# EAGLE design DRV8711 Breakout Minimal (EAGLE 7.5.0)
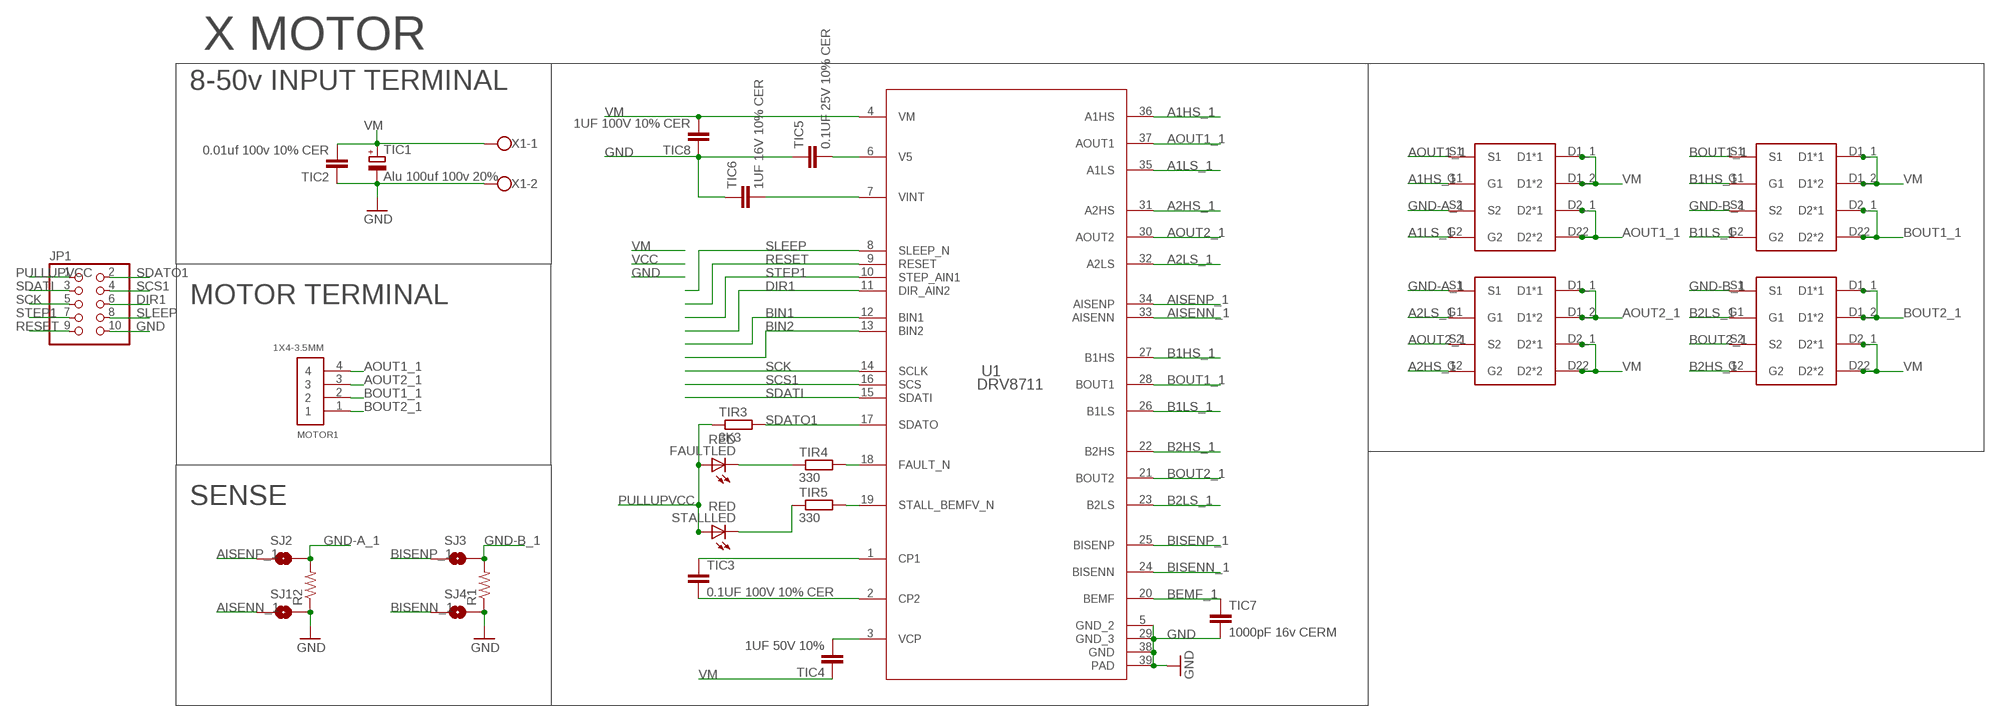
[diagram p0: schematic, sheet 1]

## Parts
FAULTLED  RED  LEDSMT1206  [1206]
JP1  PINHD-2X5  [2X05]
MOTOR1  1X4-3.5MM  [1X04-3.5MM]
R1  R-US_R2512  [R2512]
R2  R-US_R2512  [R2512]
SJ1  SOLDERJUMPERTRACE  [SJ_2S-TRACE]
SJ2  SOLDERJUMPERTRACE  [SJ_2S-TRACE]
SJ3  SOLDERJUMPERTRACE  [SJ_2S-TRACE]
SJ4  SOLDERJUMPERTRACE  [SJ_2S-TRACE]
STALLLED  RED  LEDSMT1206  [1206]
TIC1  Alu 100uf 100v 20%  CPOL-EUE  [PANASONIC_E]
TIC2  0.01uf 100v 10% CER  C-EUC1206K  [C1206K]
TIC3  0.1UF 100V 10% CER  C-EUC1206K  [C1206K]
TIC4  1UF 50V 10%  C-EUC1206K  [C1206K]
TIC5  0.1UF 25V 10% CER  C-EUC1206K  [C1206K]
TIC6  1UF 16V 10% CER  C-EUC1206K  [C1206K]
TIC7  1000pF 16v CERM  C-EUC1206K  [C1206K]
TIC8  1UF 100V 10% CER  C-EUC1206K  [C1206K]
TIR3  3K3  R-EU_R1206  [R1206]
TIR4  330  R-EU_R1206  [R1206]
TIR5  330  R-EU_R1206  [R1206]
U1  DRV8711  DRV8711DCPR  [DCP0038A_N]
U$1  CSD88537ND  [CSD88537ND]
U$2  CSD88537ND  [CSD88537ND]
U$3  CSD88537ND  [CSD88537ND]
U$4  CSD88537ND  [CSD88537ND]
X1  W237-102  [W237-102]

## Nets
A1HS_1: U1.36(A1HS) U$1.G1
A1LS_1: U1.35(A1LS) U$1.G2
A2HS_1: U1.31(A2HS) U$3.G2
A2LS_1: U1.32(A2LS) U$3.G1
AISENN_1: SJ1.1 U1.33(AISENN)
AISENP_1: SJ2.1 U1.34(AISENP)
AOUT1_1: MOTOR1.4 U1.37(AOUT1) U$1.D2_1(D2*1) U$1.D22(D2*2) U$1.S1
AOUT2_1: MOTOR1.3 U1.30(AOUT2) U$3.D1_1(D1*1) U$3.D1_2(D1*2) U$3.S2
B1HS_1: U1.27(B1HS) U$2.G1
B1LS_1: U1.26(B1LS) U$2.G2
B2HS_1: U1.22(B2HS) U$4.G2
B2LS_1: U1.23(B2LS) U$4.G1
BEMF_1: TIC7.1 U1.20(BEMF)
BIN1: U1.12(BIN1)
BIN2: U1.13(BIN2)
BISENN_1: SJ4.1 U1.24(BISENN)
BISENP_1: SJ3.1 U1.25(BISENP)
BOUT1_1: MOTOR1.2 U1.28(BOUT1) U$2.D2_1(D2*1) U$2.D22(D2*2) U$2.S1
BOUT2_1: MOTOR1.1 U1.21(BOUT2) U$4.D1_1(D1*1) U$4.D1_2(D1*2) U$4.S2
CP1_1: TIC3.1 U1.1(CP1)
CP2_1: TIC3.2 U1.2(CP2)
DIR1: JP1.6 U1.11(DIR_AIN2)
FAULT_N1: TIR4.2 U1.18(FAULT_N)
FAULTLED: FAULTLED.C TIR4.1
GND: JP1.10 R1.1 R2.1 SJ1.2 SJ4.2 TIC1.- TIC2.1 TIC5.1 TIC6.1 TIC7.2 TIC8.1 U1.5(GND_2) U1.29(GND_3) U1.38(GND) U1.39(PAD) X1.2
GND-A_1: R2.2 SJ2.2 U$1.S2 U$3.S1
GND-B_1: R1.2 SJ3.2 U$2.S2 U$4.S1
PULLUPVCC: FAULTLED.A JP1.1 STALLLED.A TIR3.1
RESET: JP1.9 U1.9(RESET)
SCK: JP1.5 U1.14(SCLK)
SCS1: JP1.4 U1.16(SCS)
SDATI: JP1.3 U1.15(SDATI)
SDATO1: JP1.2 TIR3.2 U1.17(SDATO)
SLEEP: JP1.8 U1.8(SLEEP_N)
STALL_N1: TIR5.2 U1.19(STALL_BEMFV_N)
STALLLED: STALLLED.C TIR5.1
STEP1: JP1.7 U1.10(STEP_AIN1)
V5_1: TIC5.2 U1.6(V5)
VCP1: TIC4.2 U1.3(VCP)
VINT1: TIC6.2 U1.7(VINT)
VM: TIC1.+ TIC2.2 TIC4.1 TIC8.2 U1.4(VM) U$1.D1_1(D1*1) U$1.D1_2(D1*2) U$2.D1_1(D1*1) U$2.D1_2(D1*2) U$3.D2_1(D2*1) U$3.D22(D2*2) U$4.D2_1(D2*1) U$4.D22(D2*2) X1.1

## Notes on the sheet
- X MOTOR
- 8-50v INPUT TERMINAL
- MOTOR TERMINAL
- SENSE

## Library data of the parts
FAULTLED STALLLED = led:LED: LED OSRAM: - CHIPLED LG R971, LG N971, LY N971, LG Q971, LY Q971, LO R971, LY R971 LH N974, LH R974 LS Q976, LO Q976, LY Q976 LO Q996 - Hyper CHIPLED LW Q18S LB Q993, LB Q99A, LB R99A - SideLED LS A670, LO A670, LY A670, LG A670, LP A670 LB A673, LV A673, LT A673, LW A673 LH A674 LY A675 LS A676, LA A676, LO A676, LY A676, LW A676 LS A679, LY A679, LG A679 - Hyper Micro SIDELED® LS Y876, LA Y876, LO Y876, LY Y876 LT Y87S - SmartLED LW L88C, LW L88S LB L89C, LB L89S, LG L890 LS L89K, LO L89K, LY L89K LS L896, LA L896, LO L896, LY L896 - TOPLED LS T670, LO T670, LY T670, LG T670, LP T670 LSG T670, LSP T670, LSY T670, LOP T670, LYG T670 LG T671, LOG T671, LSG T671 LB T673, LV T673, LT T673, LW T673 LH T674 LS T676, LA T676, LO T676, LY T676, LB T676, LH T676, LSB T676, LW T676 LB T67C, LV T67C, LT T67C, LS T67K, LO T67K, LY T67K, LW E67C LS E67B, LA E67B, LO E67B, LY E67B, LB E67C, LV E67C, LT E67C LW T67C LS T679, LY T679, LG T679 LS T770, LO T770, LY T770, LG T770, LP T770 LB T773, LV T773, LT T773, LW T773 LH T774 LS E675, LA E675, LY E675, LS T675 LS T776, LA T776, LO T776, LY T776, LB T776 LHGB T686 LT T68C, LB T68C - Hyper Mini TOPLED® LB M676 - Mini TOPLED Santana® LG M470 LS M47K, LO M47K, LY M47K Source: http://www.osram.convergy.de LUXEON: - LUMILED® LXK2-PW12-R00, LXK2-PW12-S00, LXK2-PW14-U00, LXK2-PW14-V00 LXK2-PM12-R00, LXK2-PM12-S00, LXK2-PM14-U00 LXK2-PE12-Q00, LXK2-PE12-R00, LXK2-PE12-S00, LXK2-PE14-T00, LXK2-PE14-U00 LXK2-PB12-K00, LXK2-PB12-L00, LXK2-PB12-M00, LXK2-PB14-N00, LXK2-PB14-P00, LXK2-PB14-Q00 LXK2-PR12-L00, LXK2-PR12-M00, LXK2-PR14-Q00, LXK2-PR14-R00 LXK2-PD12-Q00, LXK2-PD12-R00, LXK2-PD12-S00 LXK2-PH12-R00, LXK2-PH12-S00 LXK2-PL12-P00, LXK2-PL12-Q00, LXK2-PL12-R00 Source: www.luxeon.com KINGBRIGHT: KA-3528ASYC Source: www.kingbright.com
JP1 = pinhead:PINHD-2X5: PIN HEADER
MOTOR1 = adafruit:1X4: 4-pin connector
R1 R2 = adafruit:R-US_: RESISTOR, American symbol
SJ1-SJ4 = SparkFun:SOLDERJUMPER: Solder Jumper Standard SMD solder jumper. Used to automate production. Two varients : Normally Open and Normally Closed are the same, but have different paste layers. NC will have a large amount of paste and should jumper during reflow.
TIC1 = resistor:CPOL-EU: POLARIZED CAPACITOR, European symbol
TIC2-TIC8 = rcl:C-EU: CAPACITOR, European symbol
TIR3-TIR5 = rcl:R-EU_: RESISTOR, European symbol
U1 = tidrv8711:DRV8711DCPR; ALTERNATEPARTNUMBER: DRV8711DCP; COMPTYPE: IC; MANUFACTURER: Texas Instruments; MOUNTTYPE: SMT; PACKAGEREFERENCE: DCP0038A; PARTNUMBER: DRV8711DCPR; PIN_COUNT: 39; REFDES: RefDes; ROHS: Y; TYPE: TYPE; VALUE: Value
U$1-U$4 = tidrv8711:CSD88537ND
X1 = con-wago-500:W237-102: WAGO SCREW CLAMP; MPN: 237-102; OC_FARNELL: unknown; OC_NEWARK: 70K9898

## Board
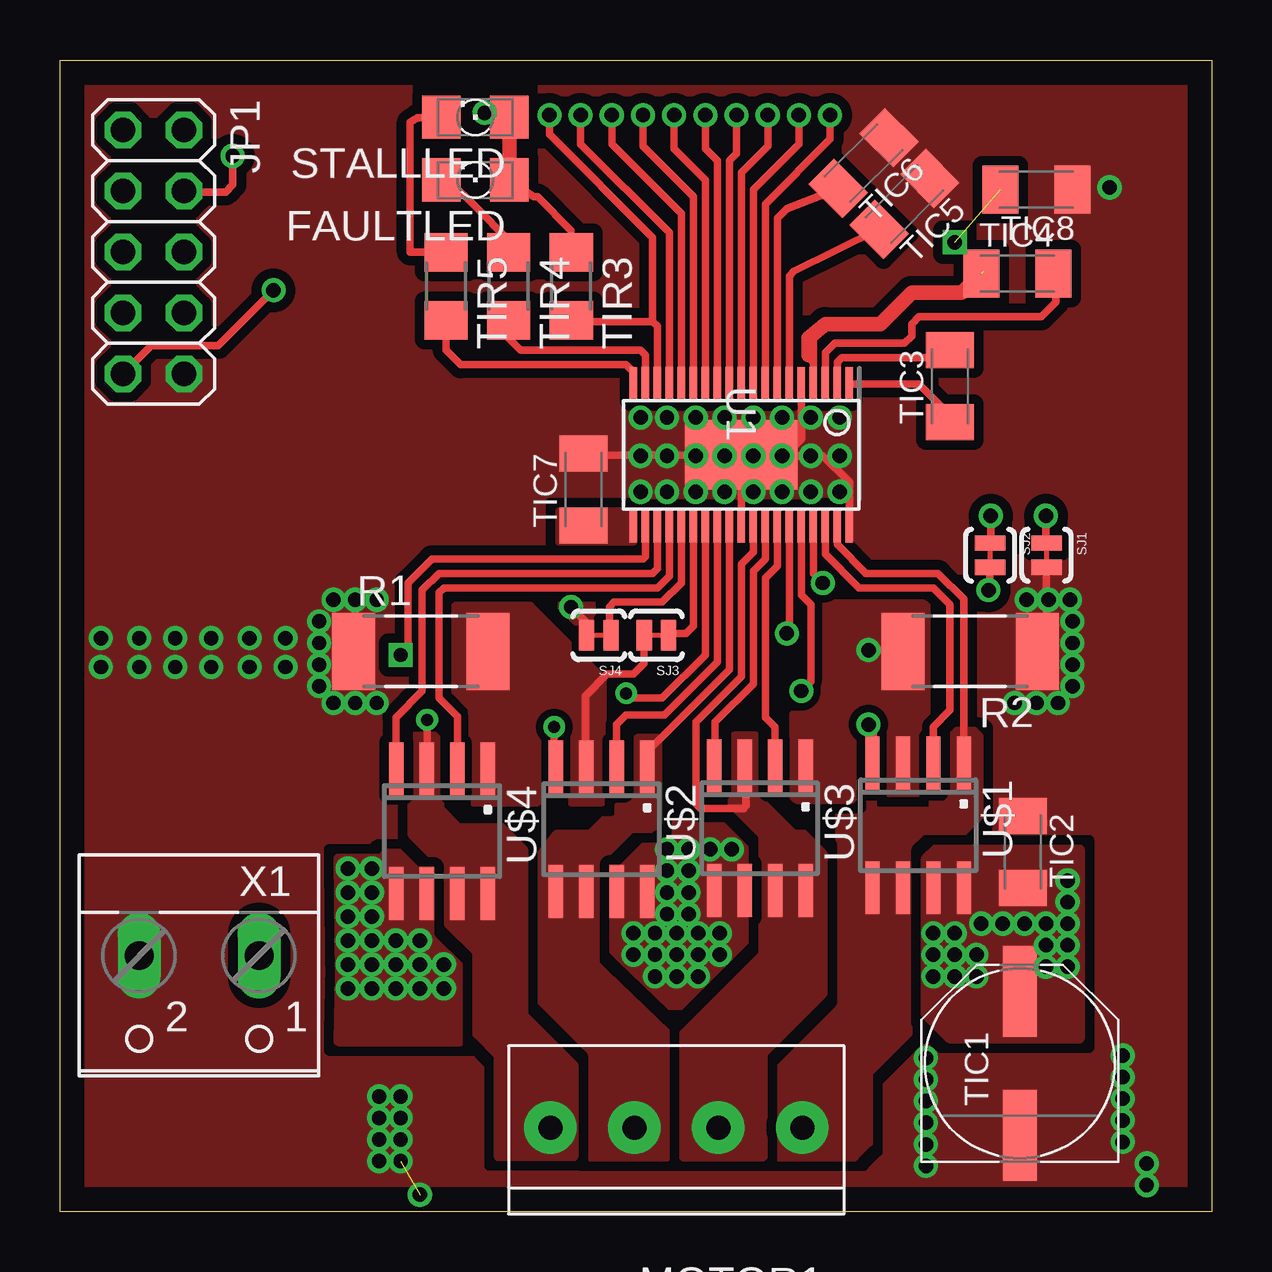
[diagram p1: board, top side]
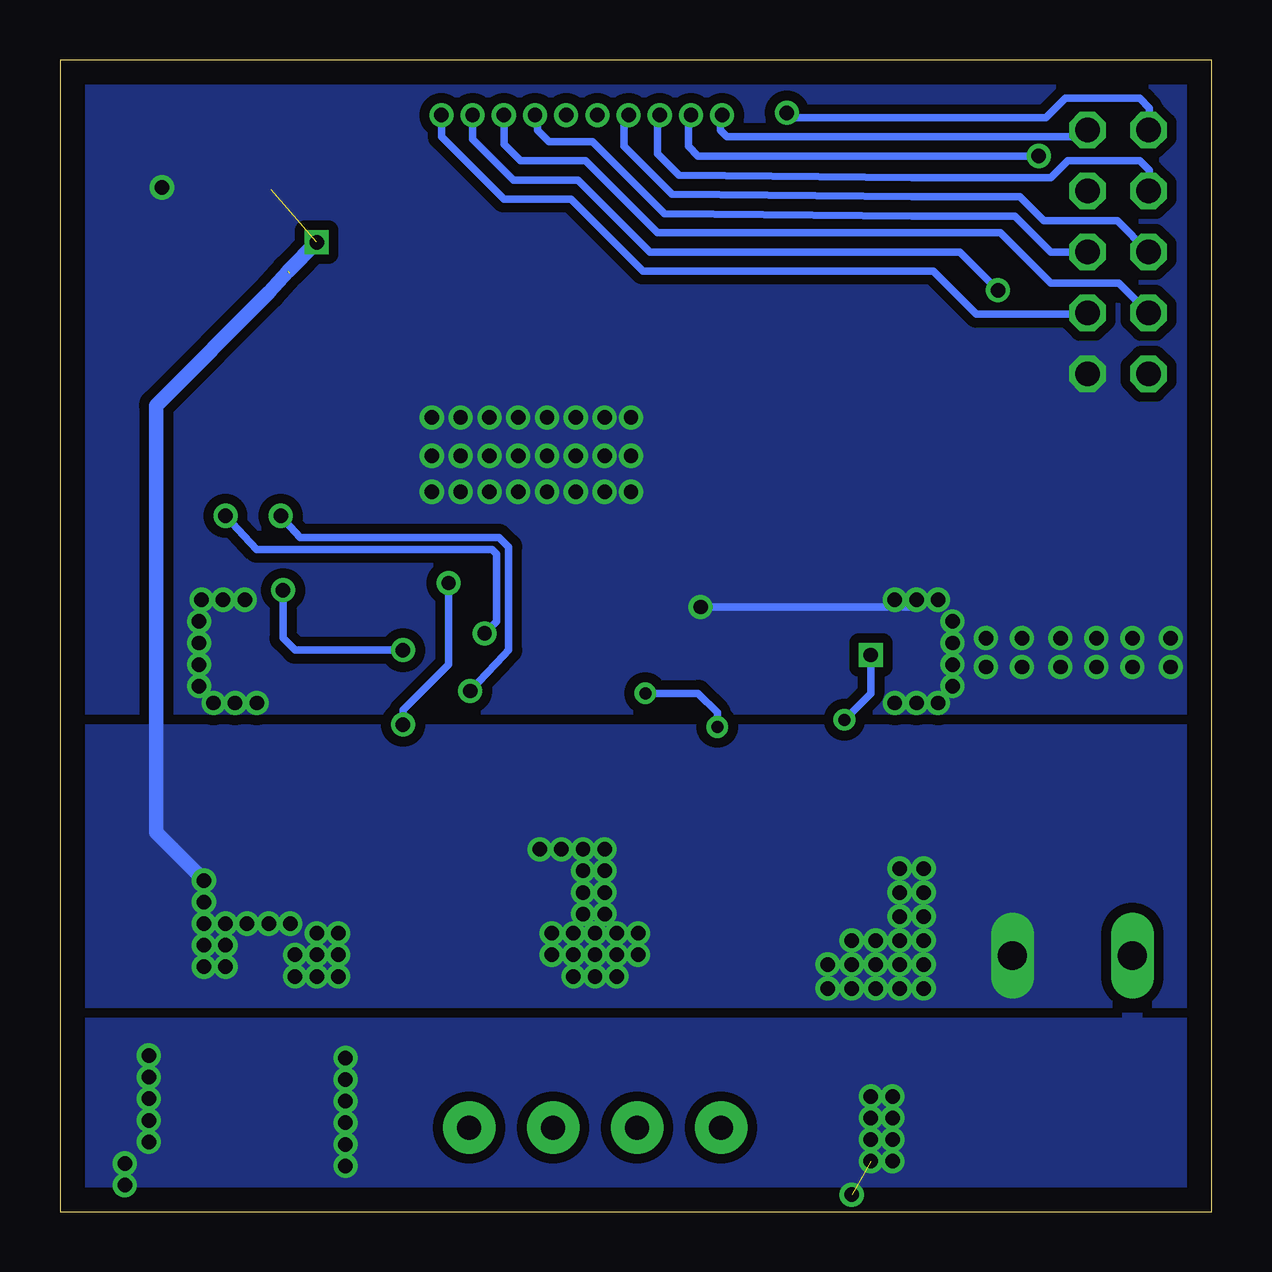
[diagram p2: board, bottom side, seen from below]

Size 48 x 48 mm. Coordinates in mm from the lower left corner, seen from the top.
Outline: 0,48 48,48 48,0 0,0 0,48
Copper layers (1*16): Top 0.035mm / dielectric 1.5mm / Bottom 0.035mm
Design rules "default": minimum track width 10mil, minimum drill 24mil, track to track 8mil, track to pad 8mil, pad to pad 8mil, via to via 8mil, smd to smd 8mil, copper to edge 40mil, drill to drill 8mil, minimum pad ring 10mil, minimum via ring 8mil, stop-mask expansion 4mil, vias tented up to drill 0mil, thermal gap 10mil

### Footprints (pad centres in the part's own frame; a part is rotated, then mirrored left to right if it is on the bottom)
1206 = smd 1.6 x 1.803: A -1.422,0; C 1.422,0
2X05 = drill 1.016 octagon: 1 -5.08,-1.27; 2 -5.08,1.27; 3 -2.54,-1.27; 4 -2.54,1.27; 5 0,-1.27; 6 0,1.27; 7 2.54,-1.27; 8 2.54,1.27; 9 5.08,-1.27; 10 5.08,1.27
1X04-3.5MM = drill 1 pad 2.184: 1 -5.25,0; 2 -1.75,0; 3 1.75,0; 4 5.25,0
R2512 = smd 1.8 x 3.2: 1 -2.8,0; 2 2.8,0
SJ_2S-TRACE = smd 0.635 x 1.27: 1 -0.508,0; 2 0.508,0
PANASONIC_E = smd 3.8 x 1.4: + 3,0; - -3,0
C1206K = smd 1.5 x 2: 1 -1.5,0; 2 1.5,0
R1206 = smd 1.6 x 1.803: 1 -1.422,0; 2 1.422,0
DCP0038A_N = smd 1.397 x 0.305: 1 -2.95,4.5; 2 -2.95,4; 3 -2.95,3.5; 4 -2.95,3; 5 -2.95,2.5; 6 -2.95,2; 7 -2.95,1.5; 8 -2.95,1; 9 -2.95,0.5; 10 -2.95,0; 11 -2.95,-0.5; 12 -2.95,-1; 13 -2.95,-1.5; 14 -2.95,-2; 15 -2.95,-2.5; 16 -2.95,-3; 17 -2.95,-3.5; 18 -2.95,-4; 19 -2.95,-4.5; 20 2.95,-4.5; 21 2.95,-4; 22 2.95,-3.5; 23 2.95,-3; 24 2.95,-2.5; 25 2.95,-2; 26 2.95,-1.5; 27 2.95,-1; 28 2.95,-0.5; 29 2.95,0; 30 2.95,0.5; 31 2.95,1; 32 2.95,1.5; 33 2.95,2; 34 2.95,2.5; 35 2.95,3; 36 2.95,3.5; 37 2.95,4; 38 2.95,4.5 | smd 2.896 x 4.699: 39 0,0
CSD88537ND = smd 0.6 x 2.2: D1_1 0.635,6.41; D1_2 1.905,6.41; D2_1 3.175,6.41; D22 4.445,6.41; G1 1.905,1.21; G2 4.445,1.21; S1 0.635,1.21; S2 3.175,1.21
W237-102 = drill 1.194 long: 1 -2.5,-1.27; 2 2.5,-1.27

### Placement (x,y rotation side)
FAULTLED  17.31,43 180 top
JP1  3.9,40 270 top
MOTOR1  25.69,3.5 0 top
R1  15.04,23.35 0 top
R2  37.94,23.35 180 top
SJ1  41.12,27.36 270 top
SJ2  38.77,27.36 270 top
SJ3  24.86,24.02 180 top
SJ4  22.46,24.02 180 top
STALLLED  17.31,45.61 180 top
TIC1  40.01,6.18 90 top
TIC2  40.14,14.99 270 top
TIC3  37.1,34.4 90 top
TIC4  39.9,39.1 0 top
TIC5  35.2,42 225 top
TIC6  33.5,43.7 225 top
TIC7  21.83,30.09 90 top
TIC8  40.7,42.6 180 top
TIR3  21.31,38.56 270 top
TIR4  18.7,38.56 270 top
TIR5  16.09,38.56 270 top
U1  28.4,31.54 270 top
U$1  38.31,19.91 180 top
U$2  25.11,19.75 180 top
U$3  31.71,19.79 180 top
U$4  18.47,19.67 180 top
X1  5.8,9.4 180 top

### Tracks (layer width: path | path; a pad name or v marks a point on that pad's centre or on a via)
A1HS_1
  Top 0.305: U$1.G1 36.41,20.2 37.1,20.9 37.1,25.3 36.4,26 33.3,26 31.9,27.4 31.9,29.19 U1.36
A1LS_1  (via drill 0.6)
  Top 0.305: U1.35 31.4,26.6 v31.8,26.2 | v33.7,20.3 33.7,20.1 33.9,19.9 33.9,18.73 U$1.G2
  Bottom 0.305: v31.8,26.2 31.8,22.8 33.7,20.9 v33.7,20.3
A2HS_1
  Top 0.305: U$3.G2 27.3,18.61 27.3,20.4 28.9,22 28.9,26.7 29.4,27.2 U1.31
A2LS_1
  Top 0.305: U1.32 29.9,26.9 29.4,26.4 29.4,20.6 29.8,20.2 U$3.G1
AISENN_1  (via drill 0.6)
  Top 0.305: U1.33 30.4,24.2 v30.3,24.1 | v41.1,29 41.1,27.89 SJ1.1
  Bottom 0.305: v41.1,29 39.8,27.6 30,27.6 29.8,27.4 29.8,24.6 v30.3,24.1
AISENP_1  (via drill 0.6)
  Top 0.305: v38.8,29 38.8,27.9 SJ2.1 | U1.34 30.9,25.7 31.3,25.3 31.3,22.1 v30.9,21.7
  Bottom 0.305: v38.8,29 38,28.1 29.7,28.1 29.3,27.7 29.3,23.4 29.5,23.2 v30.9,21.7
AOUT1_1
  Top 0.305: U$1.S1 37.67,25.52 36.6,26.6 33.6,26.6 32.4,27.8 U1.37
  pour Top (isolate 0.406, rank 3, no thermals): 38.1,20 37.4,20 37.2,19.8 37.2,17.2 36.9,16.9 32.5,16.9 32.5,8.8 29.9,6 29.9,2.3 33.1,2.3 33.7,2.9 33.7,5.8 35.8,7.9 35.8,11.8 35.6,12 35.6,15.3 36.1,15.8 37.6,15.8 38.3,16.5 38.3,19.8
AOUT2_1
  Top 0.305: U$3.S2 28.6,18.52 28.6,16.9 28.5,16.8 26.7,16.8 26.5,17 26.5,20.4 28.4,22.3 28.4,27 28.9,27.5 U1.30
  pour Top (isolate 0.406, no thermals): 29,19.8 28.1,19.8 28,19.7 28,17 29.3,15.7 29.3,10.7 26,7.4 26,2.3 29.3,2.3 29.3,6.6 31.8,9.1 31.8,14.9 31,15.7 30.6,15.7 29.2,17.1 29.2,19.6
B1HS_1
  Top 0.305: U1.27 27.4,22.9 25.2,20.7 23.6,20.7 23.2,20.3 U$2.G1
B1LS_1  (via drill 0.5)
  Top 0.305: U1.26 26.9,23.2 25.1,21.4 23.8,21.4 v23.6,21.6 | v20.6,20.2 20.6,18.61 U$2.G2
  Bottom 0.305: v23.6,21.6 21.4,21.6 20.6,20.8 v20.6,20.2
B2HS_1
  Top 0.305: U1.22 24.9,26.8 24.7,26.6 15.8,26.6 15.1,25.9 15.1,21.7 14,20.6 14,18.48 U$4.G2
B2LS_1
  Top 0.305: U$4.G1 16.57,20.64 15.8,21.4 15.8,25.8 16,26 24.9,26 25.4,26.5 25.4,29.19 U1.23
BEMF_1
  pour Top (no thermals): 23.9,27.9 20.8,27.9 20.8,29.2 23.9,29.2
BIN1  (via drill 0.6)
  Top 0.305: U1.12 27.4,43.8 26.9,44.3 v26.9,45.7
BIN2  (via drill 0.6)
  Top 0.305: U1.13 26.9,43 25.6,44.3 v25.6,45.7
BISENN_1
  Top 0.305: U1.24 25.9,26.2 25.1,25.4 23.1,25.4 22.9,25.2 22.9,24.17 SJ4.1
BISENP_1
  Top 0.305: U1.25 26.4,24.4 26.1,24.1 25.39,24.1 SJ3.1
BOUT1_1
  Top 0.305: U1.28 27.9,22.6 24.5,19.2 24.5,18.57 U$2.S1
  pour Top (isolate 0.406, rank 3, no thermals): 24.9,19.7 24.1,19.7 23.9,19.5 23.9,17.1 23.5,17.1 22.1,15.7 20.7,15.7 20,14.8 20,8.5 22.1,6.4 22.1,2.3 25.3,2.3 25.3,7.4 22.7,9.9 22.3,10.3 22.3,14.5 23.8,16 24.7,16 24.9,16.2
BOUT2_1  (via drill 0.5, 0.6)
  Top 0.305: U1.21 24.4,27.3 24.3,27.2 15.5,27.2 14.5,26.2 14.5,23.5 v14.2,23.2 | v15.3,20.5 U$4.S2
  Bottom 0.305: v14.2,23.2 14.2,21.6 v15.3,20.5
  pour Top (isolate 0.406, no thermals): 15.8,19.6 15.8,16.8 16.6,16 18.4,16 19.3,15.1 19.3,8.2 21.4,6.1 21.4,2.3 18.3,2.3 18.3,6.5 17.4,7.4 17.4,10.8 16.2,12 16.2,14.2 14.7,15.7 14.7,19.7 14.8,19.8 15.6,19.8
CP1_1
  Top 0.305: TIC3.1 37.1,33.2 35.8,34.5 U1.1
CP2_1
  Top 0.305: U1.2 32.4,35.4 32.6,35.6 36.8,35.6 TIC3.2
DIR1  (via drill 0.6 pad 0.25)
  Top 0.305: U1.11 27.9,43.8 28.2,44.1 v28.2,45.7
  Bottom 0.305: v28.2,45.7 28.1,45.6 28.1,45.08 27.62,44.6 25.8,44.6 22.8,41.6 12.5,41.5 8.2,41.5 6.7,40 JP1.6
FAULT_N1
  Top 0.305: U1.18 24.4,35.7 24.2,35.9 19.2,35.9 18.7,36.4 TIR4.2
FAULTLED
  Top 0.305: TIR4.1 18.7,40.5 17.3,41.9 16.3,42.89 FAULTLED.C
GND  (via drill 0.6)  (1 unrouted)
  Top 0.305: SJ4.2 21.95,24.55 v21.3,25.2 | v12.3,25.5 12.3,23.41 R1.1 | SJ1.2 41.12,23.73 R2.1 | U1.38 32.9,30.4 31.8,31.5 30.2,31.5 | 30.2,31.5 28.44,31.5 U1.39 | U1.29 U1.39 | U1.39 22.68,31.54 TIC7.2 | U1.5 30.9,32.2 30.2,31.5
  Bottom 0.305: v21.3,25.2 12.4,25.2 v12.3,25.5
  other vias: 10.8,24.6 10.8,23.7 10.8,22.8 10.8,21.9 11.4,21.2 12.3,21.2 13.2,21.2 11.4,25.5 13.2,25.5 39.8,21.2 40.7,21.2 41.6,21.2 42.2,21.9 42.2,22.8 42.2,23.7 42.2,24.6 36.1,6.4 36.1,5.5 36.1,4.6 36.1,3.7 36.1,2.8 36.1,1.9 44.3,6.5 45.3,1.1 15,0.7 14.2,3 45.3,2 44.3,2.9 44.3,3.8 44.3,4.7 44.3,5.6 28.9,30 27.7,30 26.5,30 25.3,30 24.2,30 30.1,30 31.3,30 32.5,30 28.9,31.5 27.7,31.5 26.5,31.5 25.3,31.5 24.2,31.5 30.1,31.5 31.3,31.5 32.5,31.5 28.9,33.1 27.7,33.1 26.5,33.1 25.3,33.1 24.2,33.1 31.3,33.1 32.5,33.1 30.1,33.1 43.75,42.69 42.1,25.5 41.2,25.5 40.3,25.5 14.2,4.8 14.2,2.1 13.3,2.1 13.3,3 13.3,3.9 13.3,4.8 14.2,3.9 4.8,23.9 4.8,22.7 3.3,23.9 3.3,22.7 1.7,23.9 1.7,22.7 9.4,23.9 9.4,22.7 7.9,23.9 7.9,22.7 6.3,23.9 6.3,22.7
  pour Bottom (isolate 0.406, rank 3): 48,8.1 0,8.1 0,0 48,0
  pour Top (isolate 0.406, rank 6, no thermals): 48,0 0,0 0,48 48,48
  pour Bottom (isolate 0.406, rank 6, no thermals): 47.6,20.3 48,48 0,48 0.13,24.83 0.13,20.6
GND-A_1  (via drill 0.6)
  Top 0.305: SJ2.2 38.77,26.07 v38.7,25.9 | v33.7,23.4 35.09,23.4 R2.2
  Bottom 0.305: v38.7,25.9 38.7,23.9 38.2,23.4 v33.7,23.4
  pour Top (isolate 0.305, no thermals): 30.7,17.2 33,17.2 33,20.9 34.5,20.9 34.5,17.5 35.8,17.5 35.8,20.4 36.1,20.7 36.1,25.2 36,25.3 31.3,25.3 30.9,24.9 30.9,21 30.6,20.7 30.6,17.3
GND-B_1
  Top 0.305: SJ3.2 24.35,22.85 23.9,22.4 22.8,22.4 21.9,21.5 21.9,18.57 U$2.S2
  pour Top (isolate 0.305, no thermals): 22.6,17.1 22.6,22.2 19.6,25.2 16.5,25.2 16.5,21.7 17.2,21 17.2,17.1 19.9,17.1 19.9,20.8 21.3,20.8 21.3,17.1
PULLUPVCC  (via drill 0.6 pad 0.25)
  Top 0.305: TIR3.1 21.31,40.89 19.9,42.3 19.73,42.3 FAULTLED.A | v17.7,45.8 18.54,45.8 STALLLED.A
  Top 0.61: FAULTLED.A STALLLED.A
  Bottom 0.305: v17.7,45.8 17.8,45.6 6.9,45.6 6.1,46.4 3,46.4 2.6,46 2.6,45.11 JP1.1
RESET  (via drill 0.6, 0.6 pad 0.25)
  Top 0.305: U1.9 28.9,42.6 30.8,44.5 v30.8,45.7 | v8.9,38.4 6.6,36.1 3.81,36.1 JP1.9
  Bottom 0.305: v30.8,45.7 30.8,44.7 29.1,43 26.4,43 23.4,40 10.5,40 v8.9,38.4
SCK  (via drill 0.6)
  Top 0.305: U1.14 26.4,42.3 24.3,44.4 v24.3,45.7
  Bottom 0.305: v24.3,45.7 24.5,45.5 24.5,44.4 22.5,42.4 12.5,42.3 8,42.3 7,41.3 3.93,41.3 JP1.5
SCS1  (via drill 0.6 pad 0.25)
  Top 0.305: U1.16 25.4,40.8 21.7,44.5 v21.7,45.7 | v7.2,44 7.2,42.8 6.9,42.5 5.21,42.5 JP1.4
  Bottom 0.305: v7.2,44 21.4,44 21.8,44.4 21.8,45.6 v21.7,45.7
SDATI  (via drill 0.6 pad 0.25)
  Top 0.305: U1.15 25.9,41.6 23,44.5 v23,45.7
  Bottom 0.305: v23,45.7 23.1,45.6 23.1,44.1 22.2,43.2 12.5,43.1 6.7,43.1 6,43.8 3,43.8 2.6,43.4 2.6,42.57 JP1.3
SDATO1  (via drill 0.6 pad 0.25)
  Top 0.305: U1.17 24.9,36.9 24.7,37.1 | 24.7,37.1 21.35,37.1 TIR3.2 | 24.7,37.1 24.7,40.6 20.4,44.9 v20.4,45.7
  Bottom 0.305: v20.4,45.7 20.47,45.63 20.47,45.06 20.21,44.8 5.45,44.8 JP1.2
SLEEP  (via drill 0.6 pad 0.25)
  Top 0.305: U1.8 29.4,42 32.1,44.7 v32.1,45.7
  Bottom 0.305: v32.1,45.7 32.1,44.8 29.5,42.2 26.7,42.2 23.7,39.2 11.6,39.2 9.8,37.4 5.23,37.4 JP1.8
STALL_N1
  Top 0.305: U1.19 23.9,35 23.6,35.3 16.7,35.3 16.1,35.9 16.1,37.13 TIR5.2
STALLLED
  Top 0.305: TIR5.1 15.12,39.98 14.6,40 14.6,45.4 14.9,45.6 16.18,45.6 STALLLED.C
STEP1  (via drill 0.6 pad 0.25)
  Top 0.305: U1.10 28.4,43.3 29.5,44.4 v29.5,45.7
  Bottom 0.305: v29.5,45.7 29.5,44.5 28.8,43.8 26.1,43.8 23.1,40.8 8.8,40.8 6.7,38.7 3.87,38.7 JP1.7
V5_1
  Top 0.305: U1.6 30.4,39 30.6,39.2 TIC5.2
VCP1
  Top 0.305: U1.3 31.9,35.8 32.3,36.2 35.2,36.2 35.5,36.5 35.5,37 35.8,37.3 40.9,37.3 41.5,37.9 41.5,38.9 TIC4.2
VINT1
  Top 0.305: U1.7 29.9,41.4 30.3,41.8 TIC6.2
VM  (via drill 0.6)  (2 unrouted)
  Top 0.305: U1.4 | U1.4 31.4,35.4 | 31.4,35.7 31.4,35.4 | 31.4,35.4 31.3,35.5 | 31.2,35.6 31.3,35.5 | 31.3,35.5 31.4,35.5 31.4,36.3 31.2,35.7
  Top 0.61: 38.2,39.3 TIC4.1 37.6,38.3 35.5,38.3 34.2,37 31.9,37 31.2,36.4 31.2,35.7
  Top 0.813: 38.3,39.2 TIC4.1
  Bottom 0.61: 37.3,40.2 v37.3,40.4 38.5,39.2 39.3,38.3 44,33.6 44,15.8 v42,13.8
  other vias: 42,12 40.2,12 42,11.1 39.3,12 41.1,11.1 38.2,9.8 38.2,10.7 37.3,10.7 37.3,9.8 26.2,12.4 26.6,11.6 25.7,11.6 24.8,11.6 27.5,11.6 26.2,13.3 26.6,10.7 25.7,10.7 24.8,10.7 27.5,10.7 25.3,12.4 42,12.9 41.1,12 15,11.3 14,11.3 13,11.3 12,11.3 16,10.3 15,10.3 14,10.3 13,10.3 12,10.3 38.4,12 12,12.3 12,13.3 12,14.3 13,14.3 13,13.3 13,12.3 25.7,9.8 24.8,9.8 26.6,9.8 25.3,13.3 23.9,11.6 23.9,10.7 37.3,11.6 42,10.2 41.1,10.2 36.4,11.6 36.4,10.7 36.4,9.8 25.3,14.2 25.3,15.1 26.2,14.2 26.2,15.1 27.1,15.1 28,15.1 16,9.3 15,9.3 14,9.3 13,9.3 12,9.3
  pour Top (isolate 0.406, rank 4, no thermals): 28.7,14.7 28.7,11 26.3,8.6 24.9,8.6 22.9,10.6 22.9,14.2 23.9,15.2 24.9,15.2 25.4,15.7 25.4,16.1 25.5,16.2 27.8,16.2 28.5,15.5 28.5,14.9
  pour Top (isolate 0.406, rank 2, no thermals): 42.5,7.2 37.1,7.2 36.1,8.2 36.1,14.7 36.5,15.1 42.5,15.1
  pour Top (isolate 0.406, rank 5, no thermals): 15.5,14.9 13.6,14.9 13.4,14.7 11.6,14.7 11.66,9.83 11.6,7.1 16.7,7.1 16.7,10.6 15.6,11.7 15.6,14.8
  pour Bottom (isolate 0.406, rank 2, no thermals): 48,8.7 0,8.7 0,20.1 48,20.1